# Altium schematic sheet dice_roller_mark1.SchDoc
size A; SheetNumber: 1; SheetTotal: 1
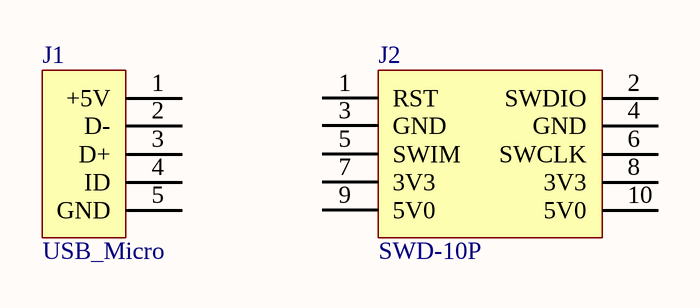
[diagram p0: dice_roller_mark1.SchDoc]

## Parts
J1  USB_Micro
J2  SWD-10P

## Nets

Not connected (* = marked no-connect by the designer): J1 1(+5V) 2(D-) 3(D+) 4(ID) 5(GND); J2 1(RST) 2(SWDIO) 3(GND) 4(GND) 5(SWIM) 6(SWCLK) 7(3V3) 8(3V3) 9(5V0) 10(5V0)

## Library data of the parts
J1 = USB_Micro: USB Connector; Manufacturer: CUI Devices; Manufacturer Part Number: UJ2-MIBH-G-SMT-TR; Supplier: Arrow Electronics; Supplier Part Number: UJ2-MIBH-G-SMT-TR; RoHS: Yes; Category: USB Connectors; Stock: 5101; Pricing: 1=0.44640, 10=0.33470, 25=0.33130, 50=0.32800, 100=0.29350, 250=0.29050, 500=0.27850, 1000=0.22440, 2000=0.20350, 3000=0.20030, 5000=0.19830, 10000=0.18800 (USD); RoHS Compliant: Yes
J2 = SWD-10P: Board Connector, 10 Contact(s), 2 Row(s), Male, Straight, Solder Terminal; Manufacturer: CNC Tech; Manufacturer Part Number: 3220-10-0100-00; Manufacturer Series: 3220; Option: General Purpose; Filter Feature: No; Number of Rows Loaded: 2; Number of Contacts: 10; Supplier: Arrow Electronics; Supplier Part Number: 3220-10-0100-00; RoHS: Yes; Category: Headers and Wire Housings; Stock: 580; Pricing: 1=0.56000, 10=0.52000, 100=0.40000, 500=0.35000, 1000=0.29000, 5000=0.25000, 10000=0.24000 (USD); Mounting Technology: Board; Contact Material: Brass; Contact Finish - Mating: GOLD FLASH; Contact Finish - Termination: GOLD FLASH; Connector Type: BOARD CONNECTOR; JESD-609 Code: e4; Contact Gender: Male; Mixed Contacts: No; Mounting Style: STRAIGHT; Termination: Solder; Terminal Pitch: 1.27mm; Flammability Rating: UL94 V-0; DIN Conformance: No; IEC Conformance: No; MIL Conformance: No; Reach SVHC Compliant: Yes; RoHS Compliant: Yes; ComponentLink1URL: https://datasheet.ciiva.com:443/pdfs/VipMasterIC/IC/CNCT/CNCT-S-A0002256941/CNCT-S-A0002256941-1.pdf?src-supplier=IHS+Markit; ComponentLink1Description: https://datasheet.ciiva.com:443/pdfs/VipMasterIC/IC/CNCT/CNCT-S-A0002256941/CNCT-S-A0002256941-1.pdf?src-supplier=IHS+Markit; ComponentLink2URL: https://datasheet.ciiva.com/18655/3220-xx-0100-00-18655342.pdf?src-supplier=Digi-Key; ComponentLink2Description: https://datasheet.ciiva.com/18655/3220-xx-0100-00-18655342.pdf?src-supplier=Digi-Key